# EAGLE design Debugger (EAGLE 9.5.0)
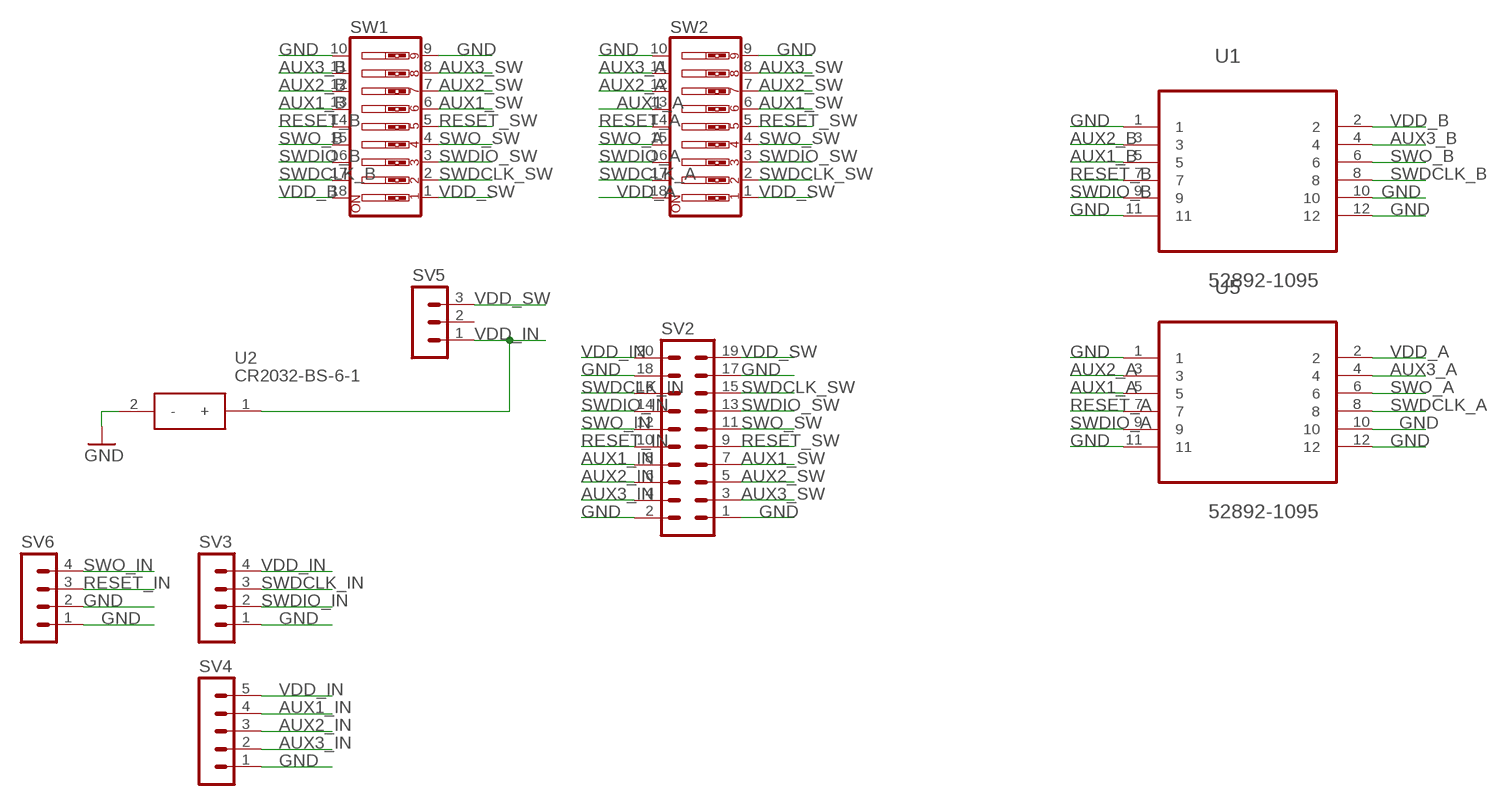
[diagram p0: schematic, sheet 1]

## Parts
SV2  MA10-2  [MA10-2]
SV3  MA04-1  [MA04-1]
SV4  MA05-1  [MA05-1]
SV5  MA03-1  [MA03-1]
SV6  MA04-1  [MA04-1]
SW1  SW_DIP-9  [EDG-09]
SW2  SW_DIP-9  [EDG-09]
U1  52892-1095  [MOLEX_52892-1095]
U2  CR2032-BS-6-1  [CR2032BS61]
U5  52892-1095  [MOLEX_52892-1095]

## Nets
AUX1_A: SW2.13 U5.5
AUX1_B: SW1.13 U1.5
AUX1_IN: SV2.8 SV4.4
AUX1_SW: SV2.7 SW1.6 SW2.6
AUX2_A: SW2.12 U5.3
AUX2_B: SW1.12 U1.3
AUX2_IN: SV2.6 SV4.3
AUX2_SW: SV2.5 SW1.7 SW2.7
AUX3_A: SW2.11 U5.4
AUX3_B: SW1.11 U1.4
AUX3_IN: SV2.4 SV4.2
AUX3_SW: SV2.3 SW1.8 SW2.8
GND: SV2.1 SV2.2 SV2.17 SV2.18 SV3.1 SV4.1 SV6.1 SV6.2 SW1.9 SW1.10 SW2.9 SW2.10 U1.1 U1.10 U1.11 U1.12 U2.2(-) U5.1 U5.10 U5.11 U5.12
RESET_A: SW2.14 U5.7
RESET_B: SW1.14 U1.7
RESET_IN: SV2.10 SV6.3
RESET_SW: SV2.9 SW1.5 SW2.5
SWDCLK_A: SW2.17 U5.8
SWDCLK_B: SW1.17 U1.8
SWDCLK_IN: SV2.16 SV3.3
SWDCLK_SW: SV2.15 SW1.2 SW2.2
SWDIO_A: SW2.16 U5.9
SWDIO_B: SW1.16 U1.9
SWDIO_IN: SV2.14 SV3.2
SWDIO_SW: SV2.13 SW1.3 SW2.3
SWO_A: SW2.15 U5.6
SWO_B: SW1.15 U1.6
SWO_IN: SV2.12 SV6.4
SWO_SW: SV2.11 SW1.4 SW2.4
VDD_A: SW2.18 U5.2
VDD_B: SW1.18 U1.2
VDD_IN: SV2.20 SV3.4 SV4.5 SV5.1 U2.1(+)
VDD_SW: SV2.19 SV5.3 SW1.1 SW2.1
Unconnected: SV5.2

## Library data of the parts
SV2 = con-lstb:MA10-2: PIN HEADER; OC_FARNELL: unknown; OC_NEWARK: unknown
SV3 SV6 = con-lstb:MA04-1: PIN HEADER; OC_FARNELL: unknown; OC_NEWARK: unknown
SV4 = con-lstb:MA05-1: PIN HEADER; OC_FARNELL: unknown; OC_NEWARK: unknown
SV5 = con-lstb:MA03-1: PIN HEADER; OC_FARNELL: unknown; OC_NEWARK: unknown
SW1 SW2 = special:SW_DIP-9: DIP SWITCH
U1 U5 = 52892-1095:52892-1095: CONNECTOR, FPC, ZIF, 0.50MM, 10 WAY; AVAILABILITY: Unavailable; DESCRIPTION: Socket, r/a, Fpc, Zif, Smt, 10way; MF: Molex; MP: 52892-1095; PACKAGE: None; PRICE: None
U2 = CR2032-BS-6-1:CR2032-BS-6-1: Battery Holders, Clips & Contacts SMD RoHS Source: Datasheet <https://datasheet.lcsc.com/szlcsc/Q-J-CR2032-BS-6-1_C70377.pdf>; DESCRIPTION: Battery Holders, Clips & Contacts SMD RoHS; HEIGHT: 6mm; MANUFACTURER_NAME: Q&J; MANUFACTURER_PART_NUMBER: CR2032-BS-6-1

## Board
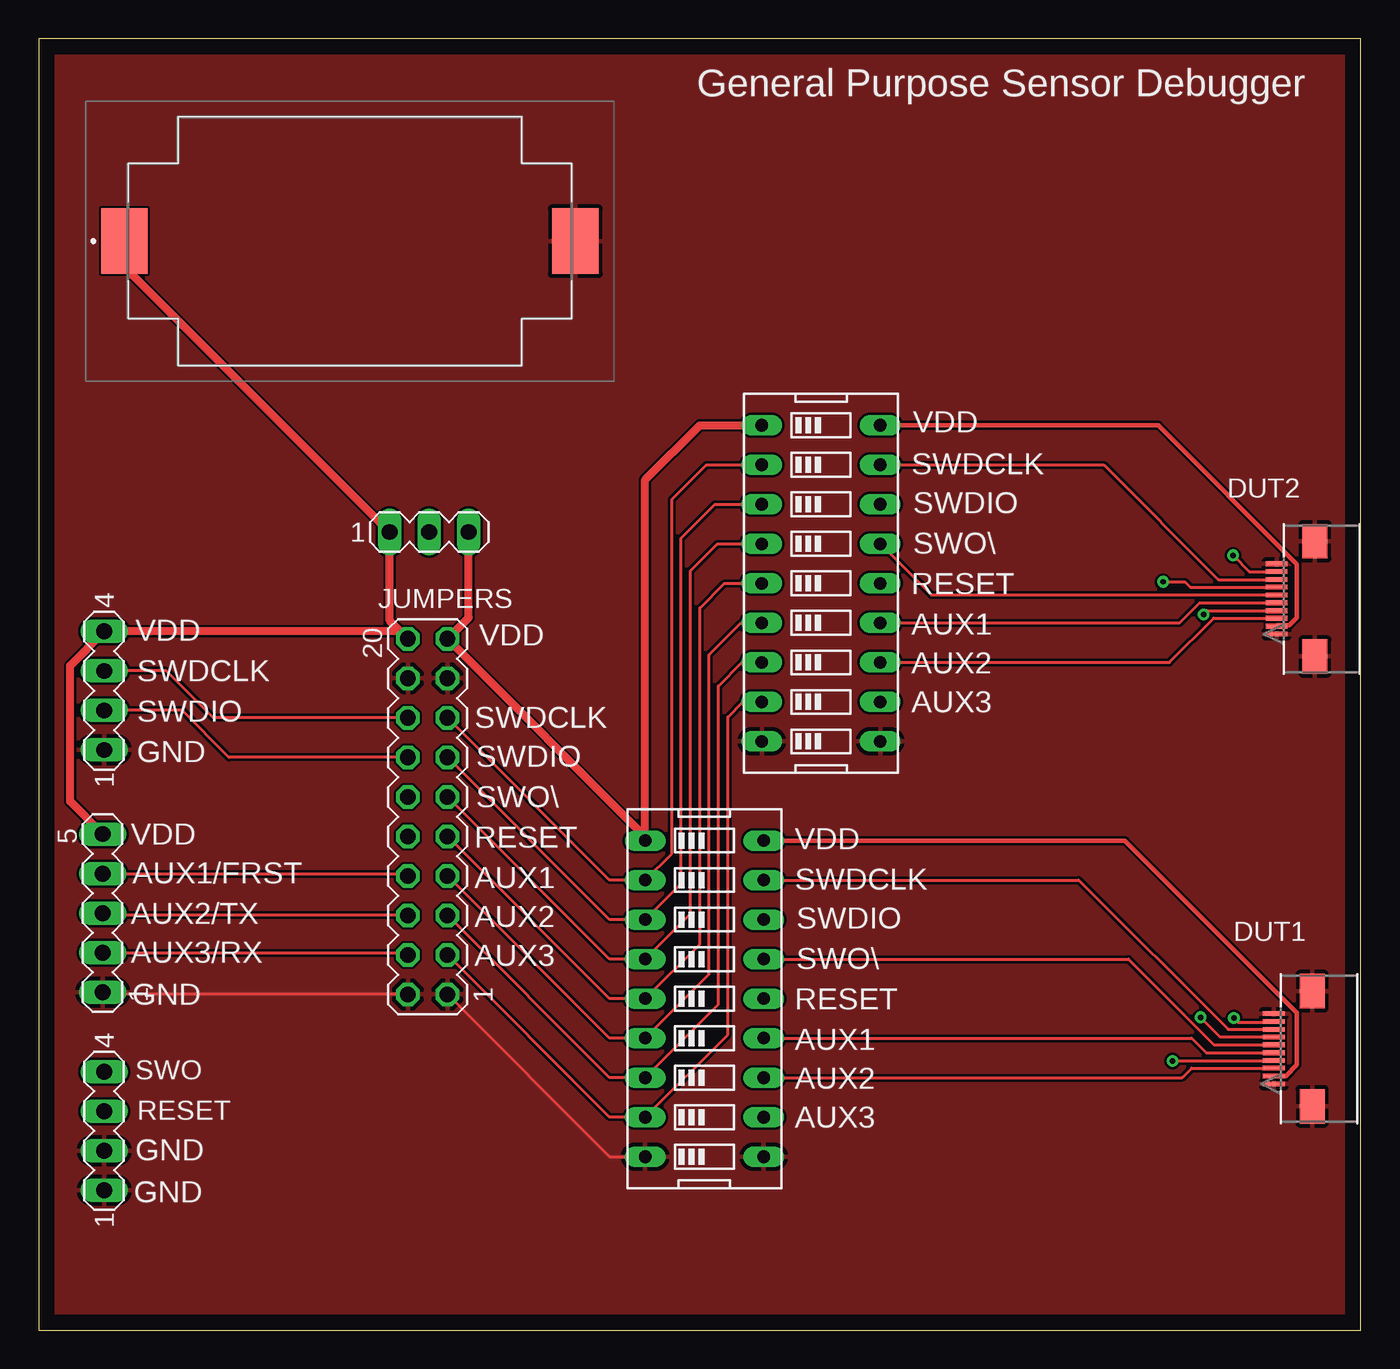
[diagram p1: board, top side]
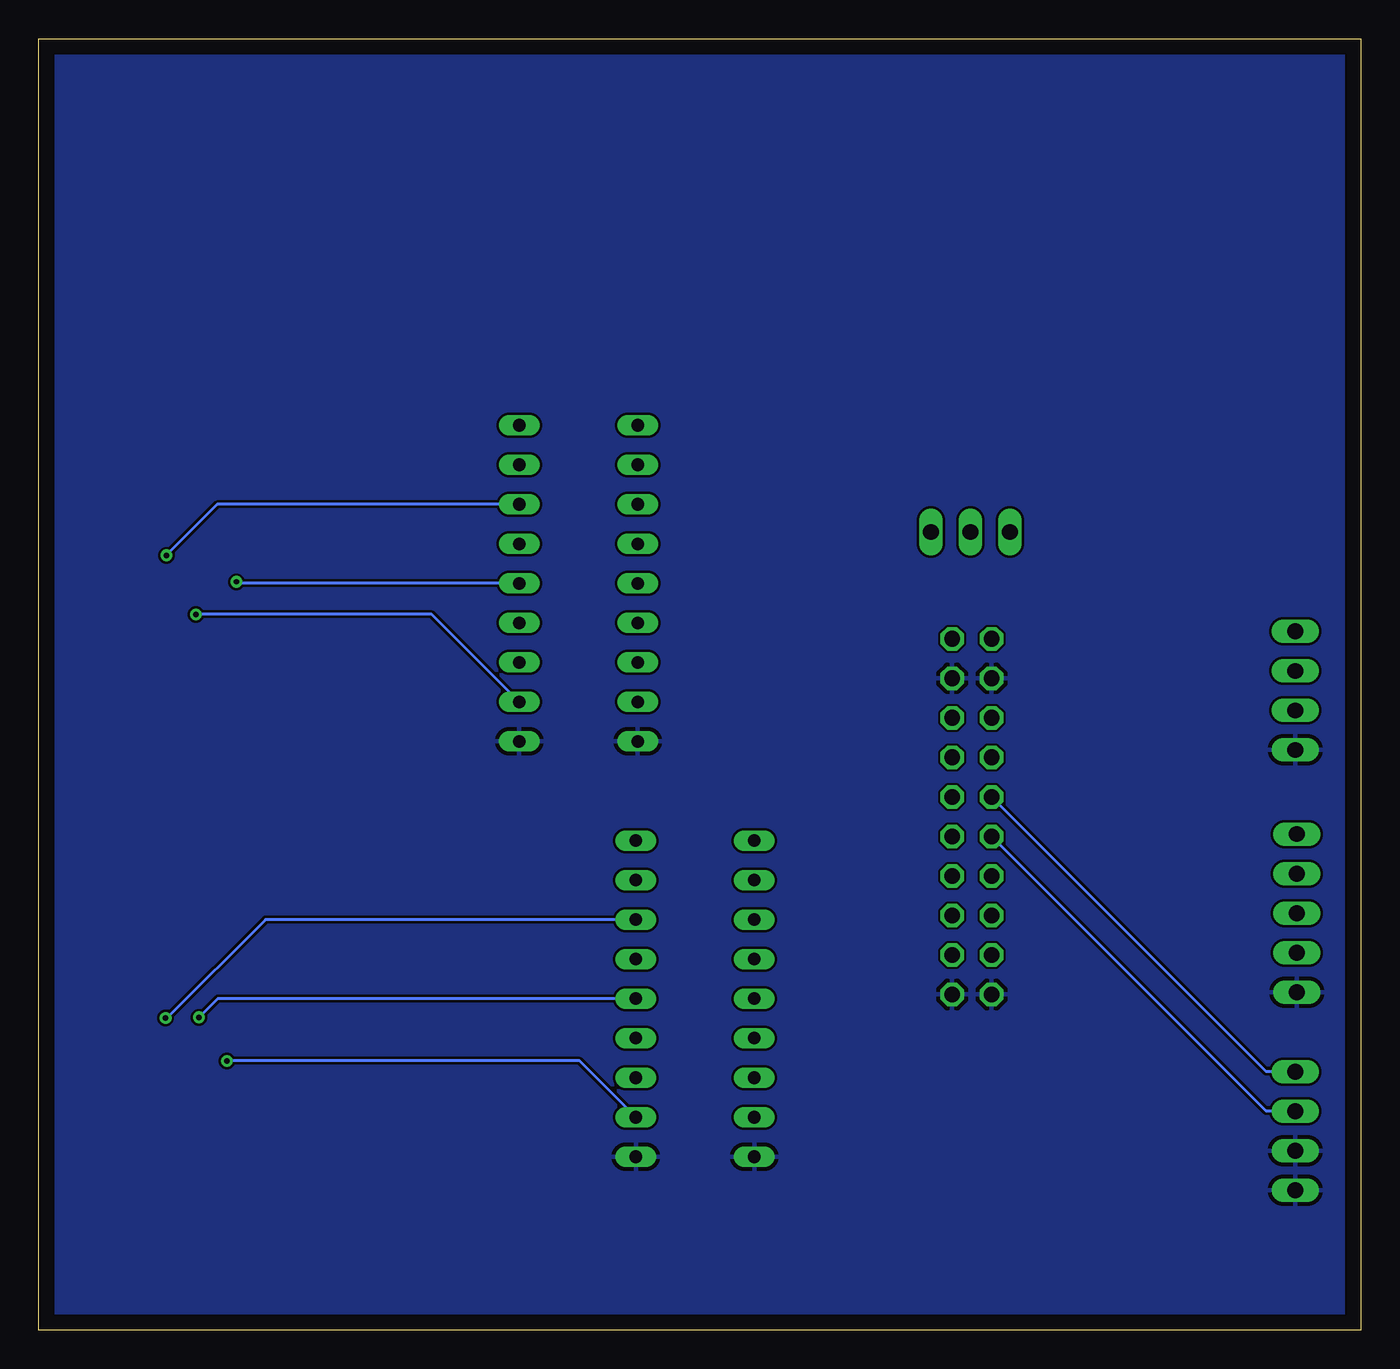
[diagram p2: board, bottom side, seen from below]

Size 85 x 83 mm. Coordinates in mm from the lower left corner, seen from the top.
Outline: 0,0 85,0 85,83 0,83 0,0
Copper layers (1*16): Top 0.035mm / dielectric 1.5mm / Bottom 0.035mm
Design rules "default": minimum track width 6mil, minimum drill 0.35mm, track to track 6mil, track to pad 6mil, pad to pad 6mil, via to via 6mil, smd to smd 6mil, copper to edge 40mil, drill to drill 6mil, minimum pad ring 10mil, minimum via ring 8mil, stop-mask expansion 4mil, vias tented up to drill 0mil, thermal gap 10mil

### Footprints (pad centres in the part's own frame; a part is rotated, then mirrored left to right if it is on the bottom)
MA10-2 = drill 1.016 octagon: 1 -11.43,-1.27; 2 -11.43,1.27; 3 -8.89,-1.27; 4 -8.89,1.27; 5 -6.35,-1.27; 6 -6.35,1.27; 7 -3.81,-1.27; 8 -3.81,1.27; 9 -1.27,-1.27; 10 -1.27,1.27; 11 1.27,-1.27; 12 1.27,1.27; 13 3.81,-1.27; 14 3.81,1.27; 15 6.35,-1.27; 16 6.35,1.27; 17 8.89,-1.27; 18 8.89,1.27; 19 11.43,-1.27; 20 11.43,1.27
MA04-1 = drill 1.016 long: 1 -3.81,0; 2 -1.27,0; 3 1.27,0; 4 3.81,0
MA05-1 = drill 1.016 long: 1 -5.08,0; 2 -2.54,0; 3 0,0; 4 2.54,0; 5 5.08,0
MA03-1 = drill 1.016 long: 1 -2.54,0; 2 0,0; 3 2.54,0
EDG-09 = drill 0.813 long: 1 -10.16,-3.81; 2 -7.62,-3.81; 3 -5.08,-3.81; 4 -2.54,-3.81; 5 0,-3.81; 6 2.54,-3.81; 7 5.08,-3.81; 8 7.62,-3.81; 9 10.16,-3.81; 10 10.16,3.81; 11 7.62,3.81; 12 5.08,3.81; 13 2.54,3.81; 14 0,3.81; 15 -2.54,3.81; 16 -5.08,3.81; 17 -7.62,3.81; 18 -10.16,3.81
MOLEX_52892-1095 = smd 0.305 x 1.397: 1 2.261,2.896; 2 1.753,2.896; 3 1.245,2.896; 4 0.762,2.896; 5 0.254,2.896; 6 -0.254,2.896; 7 -0.762,2.896; 8 -1.245,2.896; 9 -1.753,2.896; 10 -2.261,2.896 | smd 2.21 x 1.6: 11 -3.702,5.359; 12 3.702,5.359
CR2032BS61 = smd 4.2 x 3: 1 0,14.5; 2 0,-14.5

### Placement (x,y rotation side)
SV2  25,33 90 top
SV3  4.2,41.1 90 top
SV4  4.1,26.8 90 top
SV5  25.1,51.3 0 top
SV6  4.2,12.8 90 top
SW1  50.3,48 270 top
SW2  42.8,21.3 270 top
U1  76.7,47 270 top
U2  20,70 90 top
U5  76.52,18.08 270 top

### Tracks (layer width: path | path; a pad name or v marks a point on that pad's centre or on a via)
AUX1_A
  Top 0.2: SW2.13 74.14,18.76 75.07,17.83 U5.5
AUX1_B
  Top 0.2: SW1.13 73.36,45.46 74.65,46.75 U1.5
AUX1_IN
  Top 0.2: SV4.4 23.58,29.34 SV2.8
AUX1_SW
  Top 0.2: SV2.7 36.7,18.76 SW2.6 43.1,22.87 43.1,43.4 45.16,45.46 SW1.6
AUX2_A
  Top 0.2: SW2.12 73.52,16.22 74.14,16.84 U5.3
AUX2_B
  Top 0.2: SW1.12 72.71,42.92 75.55,45.76 U1.3
AUX2_IN
  Top 0.2: SV2.6 4.25,26.65 SV4.3
AUX2_SW
  Top 0.2: SV2.5 36.7,16.22 SW2.7 43.7,20.93 43.7,41.4 45.22,42.92 SW1.7
AUX3_A  (via drill 0.35)
  Top 0.2: v72.9,17.3 79.4,17.3 U5.4
  Bottom 0.2: SW2.11 50.23,17.3 v72.9,17.3
AUX3_B  (via drill 0.35)
  Top 0.2: v74.9,46 75.14,46.24 U1.4
  Bottom 0.2: SW1.11 59.73,46 v74.9,46
AUX3_IN
  Top 0.2: SV4.2 23.58,24.26 SV2.4
AUX3_SW
  Top 0.2: SV2.3 36.7,13.68 SW2.8 44.3,18.99 44.3,39.4 45.28,40.38 SW1.8
GND
  Top 0.2: SV2.1 36.7,11.14 SW2.9 | SV2.2 4.25,21.57 SV4.1
  pour Top: -1,84 87,84 87,-1 -1,-1
  pour Bottom: -1,86 86,86 86,-1 -1,-1
RESET_A  (via drill 0.35)
  Top 0.2: v74.7,20.1 75.96,18.84 U5.7
  Bottom 0.2: SW2.14 73.5,21.3 v74.7,20.1
RESET_B  (via drill 0.35)
  Top 0.2: v72.3,48.1 73.7,48.1 74.04,47.76 U1.7
  Bottom 0.2: SW1.14 72.2,48 v72.3,48.1
RESET_IN
  Bottom 0.2: SV6.3 6.07,14.07 SV2.10
RESET_SW
  Top 0.2: SV2.9 36.7,21.3 SW2.5 42.5,24.81 42.5,46.4 44.1,48 SW1.5
SWDCLK_A
  Top 0.2: SW2.17 66.88,28.92 76.47,19.32 U5.8
SWDCLK_B
  Top 0.2: SW1.17 68.48,55.62 75.86,48.24 U1.8
SWDCLK_IN
  Top 0.2: SV2.16 11.22,39.35 8.2,42.37 SV3.3
SWDCLK_SW
  Top 0.2: SV2.15 36.7,28.92 SW2.2 40.7,30.63 40.7,53.4 42.92,55.62 SW1.2
SWDIO_A  (via drill 0.35)
  Top 0.2: v76.85,20.05 77.1,19.8 79.38,19.8 U5.9
  Bottom 0.2: SW2.16 70.42,26.38 76.8,20 v76.85,20.05
SWDIO_B  (via drill 0.35)
  Top 0.2: v76.8,49.8 77.85,48.75 U1.9
  Bottom 0.2: SW1.16 73.52,53.08 v76.8,49.8
SWDIO_IN
  Top 0.2: SV2.14 12.22,36.81 9.2,39.83 SV3.2
SWDIO_SW
  Top 0.2: SV2.13 36.7,26.38 SW2.3 41.3,28.69 41.3,50.9 43.48,53.08 SW1.3
SWO_A
  Top 0.2: SW2.15 70.07,23.84 75.57,18.33 U5.6
SWO_B
  Top 0.2: SW1.15 57.4,47.25 U1.6
SWO_IN
  Bottom 0.2: SV6.4 6.07,16.61 SV2.12
SWO_SW
  Top 0.2: SV2.11 36.7,23.84 SW2.4 41.9,26.75 41.9,48.8 43.64,50.54 SW1.4
VDD_A
  Top 0.2: 79.8,16.33 U5.2
  Top 0.305: SW2.18 69.84,31.46 80.9,20.4 80.9,17.04 80.19,16.33 79.8,16.33
VDD_B
  Top 0.305: U1.2 79.65,45.3 80.42,45.3 80.9,45.78 80.9,49.24 71.98,58.16 SW1.18
VDD_IN
  Top 0.508: SV4.5 2,33.98 2,42.71 SV3.4 23.25,44.91 SV2.20 22.56,45.6 SV5.1 5.5,68.36 U2.1
VDD_SW
  Top 0.508: SV5.3 27.64,45.8 SV2.19 38.99,31.71 SW2.1 38.99,54.65 42.5,58.16 SW1.1 | SW1.1 47.24,58.16 47.3,58.1 46.55,58.1 SW1.1

### Text on the board
tPlace: General Purpose Sensor Debugger | VDD | SWDCLK | DUT2 | SWDIO | SWO\ | RESET | JUMPERS | AUX1 | VDD | VDD | SWDCLK | AUX2 | AUX3 | SWDIO | SWDCLK | GND | SWDIO | SWO\ | VDD | RESET | VDD | AUX1/FRST | AUX1 | SWDCLK | AUX2/TX | AUX2 | SWDIO | DUT1 | AUX3/RX | AUX3 | SWO\ | GND | RESET | AUX1 | SWO | AUX2 | RESET | AUX3 | GND | GND